# EAGLE schematic saint lcd (EAGLE 9.4.2)
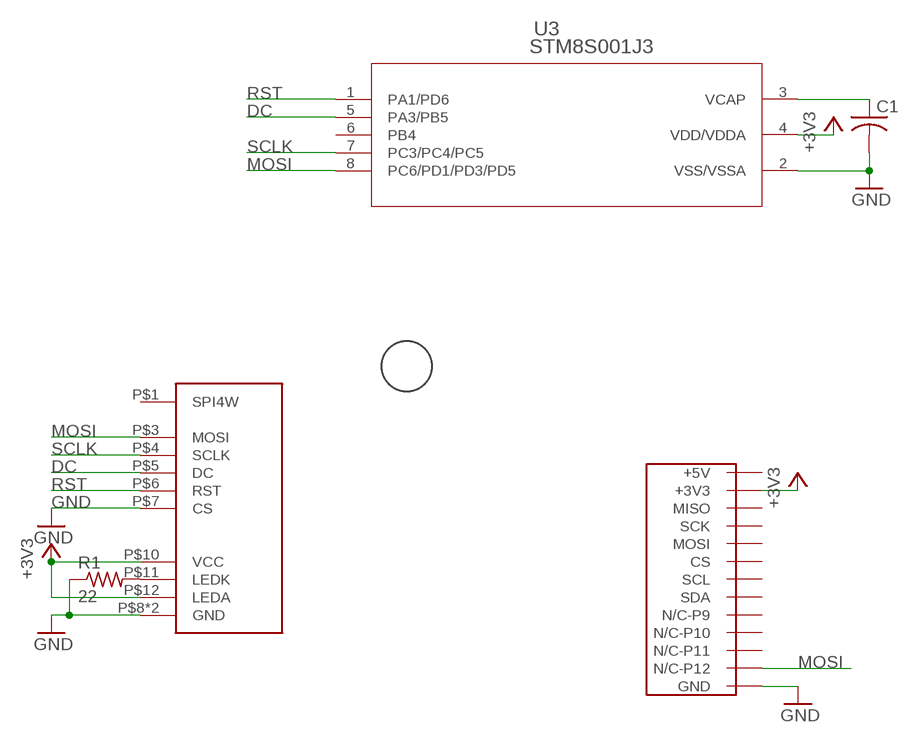
[diagram p0: schematic, sheet 1]

## Parts
C1  C-USC0603  [C0603]
R1  22  R-US_R0603  [R0603]
U3  STM8S001J3  [SOD8N_4P9X6]
U$1  BADGE64FOOTPRINT  [BADGE64-FOOTPRINT]
U$2  FPC13  [FPC13]
U$3  PLUM  [PLUM]

## Nets
+3V3: U3.4(VDD/VDDA) U$1.+3V3-P7(+3V3) U$1.+3V3-P15(+3V3) U$2.P$10(VCC) U$2.P$12(LEDA)
DC: U3.5(PA3/PB5) U$2.P$5(DC)
GND: C1.2 R1.1 U3.2(VSS/VSSA) U$1.GND-P2(GND) U$1.GND-P8(GND) U$1.GND-P16(GND) U$2.P$7(CS) U$2.P$8(GND) U$2.P$13(GND)
MOSI: U3.8(PC6/PD1/PD3/PD5) U$1.NC-P12(N/C-P12) U$2.P$3(MOSI)
N$1: R1.2 U$2.P$11(LEDK)
N$2: C1.1 U3.3(VCAP)
RST: U3.1(PA1/PD6) U$2.P$6(RST)
SCLK: U3.7(PC3/PC4/PC5) U$2.P$4(SCLK)
Unconnected: U3.6(PB4) U$1.CS U$1.MISO U$1.MOSI U$1.NC-P9(N/C-P9) U$1.NC-P10(N/C-P10) U$1.NC-P11(N/C-P11) U$1.SCK U$1.SCL U$1.SDA U$2.P$1(SPI4W)

## Power pins joined to a net without a drawn wire
+5V: U$1.+5V

## Library data of the parts
C1 = resistor:C-US: CAPACITOR, American symbol
R1 = resistor:R-US_: RESISTOR, American symbol
U3 = grange:STM8S001J3; MANUFACTURER_PART_NUMBER: STM8S001J3; VENDOR: STMicroelectronics
U$1 = MiniBadge:BADGE64
U$2 = grange:FPC13
U$3 = grange:PLUM